# EAGLE design LB_BIT_i34_RANDOM-v03(3_4)-OHW (EAGLE 6.6.0)
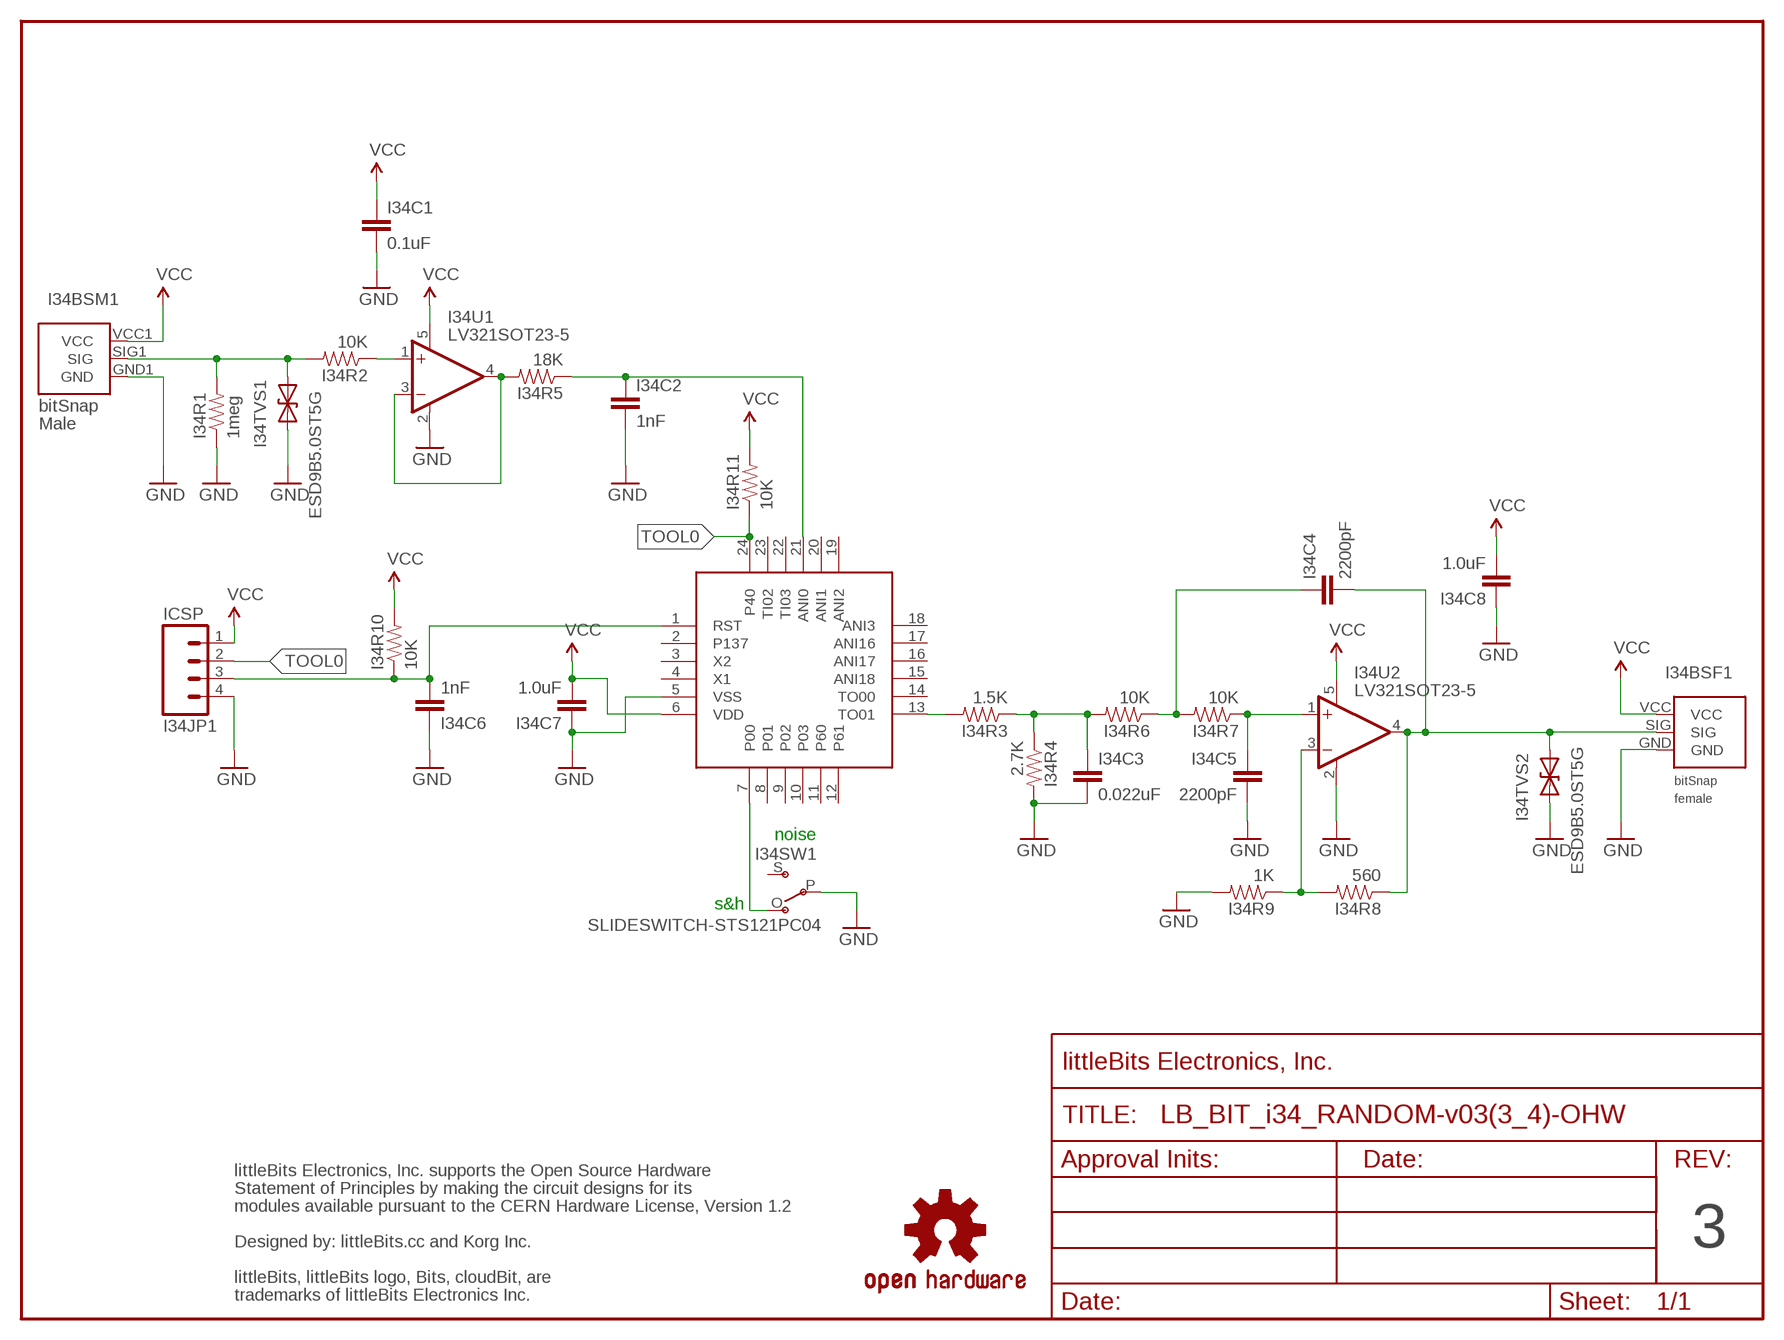
[diagram p0: schematic, sheet 1]

## Parts
I34BSF1  BITSNAP_V03_FEMALE  [BITSNAP_V03_FEMALE]
I34BSM1  BITSNAP_V03_MALE  [BITSNAP_V03_MALE]
I34C1  0.1uF  CAPCAP-0603  [CAP-0603]
I34C2  1nF  CAPCAP-0603  [CAP-0603]
I34C3  0.022uF  CAPCAP-0603  [CAP-0603]
I34C4  2200pF  CAPCAP-0603  [CAP-0603]
I34C5  2200pF  CAPCAP-0603  [CAP-0603]
I34C6  1nF  CAPCAP-0603  [CAP-0603]
I34C7  1.0uF  CAPCAP-0603  [CAP-0603]
I34C8  1.0uF  CAPCAP-0603  [CAP-0603]
I34JP1  ICSP  HDR-4SM_SML  [SIP4-SM-0.1IN-NOS.S.]
I34R1  1meg  RESISTOR0603  [RES-0603]
I34R2  10K  RESISTOR0603  [RES-0603]
I34R3  1.5K  RESISTOR0603  [RES-0603]
I34R4  2.7K  RESISTOR0603  [RES-0603]
I34R5  18K  RESISTOR0603  [RES-0603]
I34R6  10K  RESISTOR0603  [RES-0603]
I34R7  10K  RESISTOR0603  [RES-0603]
I34R8  560  RESISTOR0603  [RES-0603]
I34R9  1K  RESISTOR0603  [RES-0603]
I34R10  10K  RESISTOR0603  [RES-0603]
I34R11  10K  RESISTOR0603  [RES-0603]
I34SW1  SLIDESWITCH-STS121PC04  [SLIDESWITCH-STS121PC04]
I34TVS1  ESD9B5.0ST5G  DIODE-TVSSOD-923  [SOD-923]
I34TVS2  ESD9B5.0ST5G  DIODE-TVSSOD-923  [SOD-923]
I34U1  LV321SOT23-5  [SOT23-5]
I34U2  LV321SOT23-5  [SOT23-5]
I34U3  R5F10278QFN-24  [QFN-24(4MM)]
U$1  FRAME-LETTER-OHWOHW  [FABDWG01-OHW]
U$2  OSHWCREDIT-KORG  [OSHWCREDIT-KORG]
U$3  OSHW-LOGOL  [OSHW-LOGO-L]

## Nets
GND: I34BSF1.GND I34BSM1.GND1(GND) I34C1.2 I34C2.2 I34C3.2 I34C5.2 I34C6.1 I34C7.1 I34C8.1 I34JP1.4 I34R1.1 I34R4.2 I34R9.2 I34SW1.P I34TVS1.1(A) I34TVS2.1(A) I34U1.2(V-) I34U2.2(V-) I34U3.5(VSS)
N$1: I34C2.1 I34R5.1 I34U3.21(ANI0)
N$2: I34R5.2 I34U1.3(-IN) I34U1.4(OUT)
N$3: I34C3.1 I34R3.1 I34R4.1 I34R6.2
N$4: I34R2.1 I34U1.1(+IN)
N$5: I34R3.2 I34U3.13(TO01)
N$6: I34R8.2 I34R9.1 I34U2.3(-IN)
N$7: I34C4.1 I34R6.1 I34R7.2
N$8: I34C6.2 I34JP1.3 I34R10.1 I34U3.1(RST)
N$10: I34C5.1 I34R7.1 I34U2.1(+IN)
N$11: I34SW1.O I34U3.7(P00)
SIG_IN: I34BSM1.SIG1(SIG) I34R1.2 I34R2.2 I34TVS1.2(C)
SIG_OUT: I34BSF1.SIG I34C4.2 I34R8.1 I34TVS2.2(C) I34U2.4(OUT)
TOOL0: I34JP1.2 I34R11.1 I34U3.24(P40)
VCC: I34BSF1.VCC I34BSM1.VCC1(VCC) I34C1.1 I34C7.2 I34C8.2 I34JP1.1 I34R10.2 I34R11.2 I34U1.5(V+) I34U2.5(V+) I34U3.6(VDD)
Unconnected: I34SW1.S I34U3.2(P137) I34U3.3(X2) I34U3.4(X1) I34U3.8(P01) I34U3.9(P02) I34U3.10(P03) I34U3.11(P60) I34U3.12(P61) I34U3.14(TO00) I34U3.15(ANI18) I34U3.16(ANI17) I34U3.17(ANI16) I34U3.18(ANI3) I34U3.19(ANI2) I34U3.20(ANI1) I34U3.22(TI03) I34U3.23(TI02)

## Notes on the sheet
- noise
- s&h
- 3

## Library data of the parts
I34BSF1 = bitSnap:BITSNAP_V03_FEMALE
I34BSM1 = bitSnap:BITSNAP_V03_MALE
I34C1-I34C8 = LITTLEBITS:CAP
I34JP1 = LITTLEBITS:HDR-4: Header 4 Standard 4-pin 0.1" header. Use with straight break away headers (SKU : PRT-00116), right angle break away headers (PRT-00553), swiss pins (PRT-00743), machine pins (PRT-00117), and female headers (PRT-00115). Molex polarized connector foot print use with SKU : PRT-08231 with associated crimp pins and housings.
I34R1-I34R11 = LITTLEBITS:RESISTOR
I34SW1 = LITTLEBITS:SLIDESWITCH-STS121PC04
I34TVS1 I34TVS2 = LITTLEBITS:DIODE-TVS: Bidirectional Transient Voltage Suppression Diode: Device conducts in avalanche mode after reaching a part dependent voltage threshold. Used for limiting voltage spikes on ESD sensitive inputs and outputs.; IEC_ESD_PROT0: +/-18kV; LB_PN: ?; MPN: ESD9B5.0ST5G; V_CLAMP: ?; V_OPERATION: 5V
I34U1 I34U2 = LITTLEBITS:LV321
I34U3 = LITTLEBITS:R5F10278
U$1 = LITTLEBITS:FRAME-LETTER-OHW
U$2 = LITTLEBITS:OSHWCREDIT-KORG
U$3 = LITTLEBITS:OSHW-LOGO: Open Source Hardware Logo This logo indicates the piece of hardware it is found on incorporates a OSHW license and/or adheres to the definition of open source hardware found here: http://freedomdefined.org/OSHW

## Board
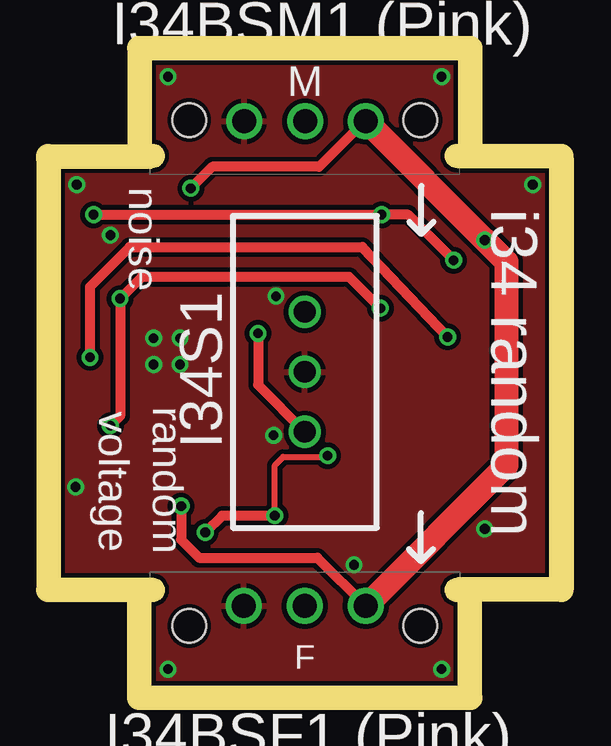
[diagram p1: board, top side]
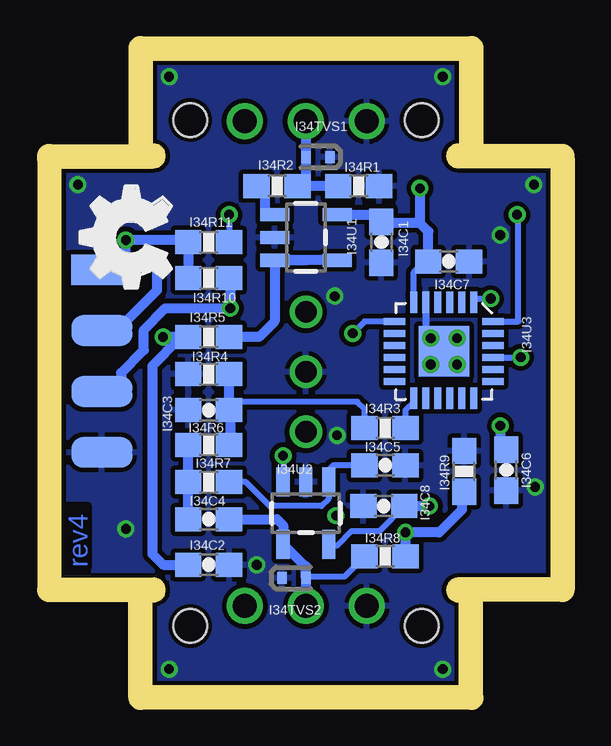
[diagram p2: board, bottom side, seen from below]

Size 20.4 x 26.1 mm. Coordinates in mm from the lower left corner, seen from the top.
Outline: 0,21.6 0,4.5
Outline: 20.4,4.5 20.4,21.6
Copper layers (1*16): Top 0.035mm / dielectric 1.5mm / Bottom 0.035mm
Design rules "littleBitsDRC": minimum track width 0.2mm, minimum drill 0.4mm, track to track 0.2mm, track to pad 0.2mm, pad to pad 0.2mm, via to via 0.2mm, smd to smd 0mil, copper to edge 0.2mm, drill to drill 0.2mm, minimum pad ring 0.2mm, minimum via ring 0.15mm, stop-mask expansion 0.1mm, vias tented up to drill 0mil, thermal gap 0.2mm
Milling: 2 lines

### Footprints (pad centres in the part's own frame; a part is rotated, then mirrored left to right if it is on the bottom)
BITSNAP_V03_FEMALE = drill 1: GND 3.91,3.33; SIG 6.45,3.33; VCC 8.99,3.33 | hole 1.4: 1.63,2.5; 11.27,2.5
BITSNAP_V03_MALE = drill 1: GND1 8.98,2.56; SIG1 6.44,2.56; VCC1 3.9,2.56 | hole 1.4: 11.27,2.5; 1.63,2.5
CAP-0603 = smd 1.1 x 1: 1 -0.85,0; 2 0.85,0
SIP4-SM-0.1IN-NOS.S. = smd 1.27 x 2.54: 1 -3.81,0; 2 -1.27,0; 3 1.27,0; 4 3.81,0
RES-0603 = smd 1.1 x 1: 1 -0.85,0; 2 0.85,0
SLIDESWITCH-STS121PC04 = drill 0.9: O 9,3; P 6.5,3; S 4,3
SOD-923 = smd 0.4 x 0.5: 1 -0.5,0; 2 0.5,0
SOT23-5 = smd 0.55 x 1.2: 1 -0.95,-1.3; 2 0,-1.3; 3 0.95,-1.3; 4 0.95,1.3; 5 -0.95,1.3
QFN-24(4MM) = smd 0.9 x 0.3: 1 0,3.3; 2 0,2.8; 3 0,2.3; 4 0,1.8; 5 0,1.3; 6 0,0.8; 13 4,0.8; 14 4,1.3; 15 4,1.8; 16 4,2.3; 17 4,2.8; 18 4,3.3 | smd 0.3 x 0.9: 7 0.8,0; 8 1.3,0; 9 1.8,0; 10 2.3,0; 11 2.8,0; 12 3.3,0; 19 3.3,4.1; 20 2.8,4.1; 21 2.3,4.1; 22 1.8,4.1; 23 1.3,4.1; 24 0.8,4.1 | smd 2.1 x 2.1: EP 2.05,2.05

### Placement (x,y rotation side)
I34BSF1  3.75,0 0 top
I34BSM1  16.65,26.1 180 top
I34C1  7.05,18.5 270 bottom
I34C2  14.25,5.05 0 bottom
I34C3  14.25,11.5 180 bottom
I34C4  14.25,6.95 0 bottom
I34C5  6.9,9.2 0 bottom
I34C6  1.85,9 90 bottom
I34C7  4.25,17.7 180 bottom
I34C8  6.95,7.5 0 bottom
I34JP1  18.7,13.55 270 bottom
I34R1  8,20.85 180 bottom
I34R2  11.4,20.85 0 bottom
I34R3  6.9,10.75 0 bottom
I34R4  14.25,13 180 bottom
I34R5  14.25,14.55 0 bottom
I34R6  14.25,10.05 0 bottom
I34R7  14.25,8.5 180 bottom
I34R8  6.9,5.4 0 bottom
I34R9  3.6,8.95 90 bottom
I34R10  14.25,17 180 bottom
I34R11  14.25,18.5 180 bottom
I34SW1  7.2,19.6 270 top
I34TVS1  9.7,22.05 180 bottom
I34TVS2  10.7,4.5 0 bottom
I34U1  10.2,18.7 270 bottom
I34U2  10.2,7.2 180 bottom
I34U3  6.5,16 270 bottom
U$1  0,0 0 top
U$2  -75.95,-69.1 0 top  (outside the outline)
U$3  -30.35,-65.4 0 top  (outside the outline)
U$4  [OSHW_FILLX150_NOTEXT]  15.8,15.75 0 top

### Tracks (layer width: path | path; a pad name or v marks a point on that pad's centre or on a via)
GND  (via drill 0.41)
  Bottom 0.3: I34U3.5 5.2,14.7
  other vias: 17.7,6.55 0.65,8.3 9,16.25 5,14.5 5,13.4 3.9,13.4 3.9,14.5 4.5,25.4 15.9,25.4 15.9,0.7 4.5,0.7 12.25,5.05 8.9,10.45 2.1,18.8 19.7,20.9 0.7,20.9
  pour Bottom: 0,0 20.4,0 20.4,26 0,26
  pour Top: 0,0 20.4,0 20.4,26 0,26
N$1  (via drill 0.41)
  Top 0.406: v1.25,13.7 1.25,16.65 2.9,18.3 12.6,18.3 v16.15,14.55
  Bottom 0.254: I34U3.21 v1.25,13.7
  Bottom 0.406: v16.15,14.55 I34R5.1 15.45,14.5 16.6,13.35 16.6,5.5 16.15,5.05 I34C2.1
N$2
  Bottom 0.406: I34U1.4 I34U1.3 | I34U1.3 10.2,17.75 | I34U1.3 11.5,15.2 12.15,14.55 I34R5.2
N$3
  Bottom 0.254: I34R3.1 7.75,11.55 8.05,11.85 13.35,11.85 I34C3.1 | 13.35,10.4 I34R6.2
  Bottom 0.406: I34C3.1 I34R4.1 | 13.35,11.85 13.35,10.4
N$4
  Bottom 0.406: I34U1.1 11.85,19.65 11.9,19.6 11.9,20.85 I34R2.1
N$5
  Bottom 0.254: I34U3.13 5.7,11.85 6.05,11.5 I34R3.2
N$6  (via drill 0.41)
  Top 0.254: v8.95,7.1 8.95,9.2 9.3,9.55 11.05,9.55 v11.15,9.6
  Top 0.406: v8.95,7.1 6.75,7.1 v6.05,6.4
  Bottom 0.254: v11.15,9.6 I34U2.3
  Bottom 0.406: 6.05,5.35 I34R8.2 v6.05,6.4 4.65,6.4 3.7,7.35 3.7,8 I34R9.1
N$7
  Bottom 0.406: I34C4.1 I34R7.2 I34R6.1 15.1,10.25
N$8  (via drill 0.41)
  Top 0.406: v2.1,10.85 2.5,11.25 v2.5,16.15 3.4,17.05 12.05,17.05 v13.35,15.75
  Bottom 0.254: 17.85,12.3 I34JP1.3 | I34U3.1 3.2,16.15 v2.5,16.15
  Bottom 0.406: I34R10.1 13.4,16.95 13.35,16.9 v13.35,15.75 16.05,15.75 16.95,14.85 16.95,14 17.9,13.05 17.9,12.4 17.95,12.45 17.85,12.3 | v2.1,10.85 2.1,10 I34C6.2
N$10
  Bottom 0.254: 13.35,8.5 I34R7.1 12.7,8.5 11.7,7.5 9.55,7.5 9.25,7.8 I34U2.1 9.25,9 9.05,9.2 I34C5.1
N$11  (via drill 0.41)
  Top 0.406: v8.25,14.7 8.25,12.55 I34SW1.O
  Bottom 0.254: I34U3.7 7.75,15.2 v8.25,14.7
SIG_IN
  Bottom 0.406: I34BSM1.SIG1 10.2,23.44 I34TVS1.2 10.2,20.85 I34R2.2 I34R1.2
SIG_OUT
  Bottom 0.254: I34R8.1 8.6,4.55 10.15,4.55 I34TVS2.2
  Bottom 0.406: I34BSF1.SIG I34TVS2.2 10.2,5 10.25,5 I34U2.4 11.15,6.7 11.4,6.95 I34C4.2
TOOL0  (via drill 0.41)
  Top 0.406: v1.4,19.65 v13.4,19.65 14.5,19.65 v16.4,17.75
  Bottom 0.254: I34U3.24 1.35,15.2 1.35,19.6 v1.4,19.65 | v13.4,19.65 I34R11.1 | I34JP1.2 17.85,14.8
  Bottom 0.406: 17.85,14.8 17.95,14.95 16.4,16.5 v16.4,17.75
VCC  (via drill 0.41)
  Top 0.406: I34BSM1.VCC1 12.6,23.45 10.8,21.65 6.35,21.65 v5.45,20.75 | v5.05,7.5 5.05,6.1 5.8,5.35 10.72,5.35 I34BSF1.VCC 12.75,3.35
  Top 1: I34BSM1.VCC1 v17.7,18.59 18.6,17.69 18.6,9.2 12.75,3.35
  Bottom 0.254: I34C8.2 7.15,6.45 8.3,6.45 8.9,5.85 9.2,5.85 I34U2.5 | I34U3.6 5.7,17.25 5.4,17.55 I34C7.2 | 7,19.3 I34C1.1
  Bottom 0.406: I34U1.5 7.05,19.65 I34C1.1 | I34C7.2 5.1,18.95 5.45,19.3 | 5.45,19.3 7,19.3 | I34JP1.1 17.7,17.36 | 17.7,17.36 17.75,17.1 | 15.14,17.1 I34R10.2 I34R11.2 15.24,18.59 v17.7,18.59 17.7,17.36 | I34C8.2 v5.05,7.5 | v5.45,20.75 5.45,19.3

### Text on the board
Bottom: rev4
tPlace: noise | i34 random | random | voltage
tNames: I34BSM1 (Pink) | I34S1 | I34BSF1 (Pink)
bValues: R5F10278
Reference: MEDIUM
dxf: 4 | 4